# Altium schematic sheet Sheet1 3-27.SchDoc
size 457 x 419 mm
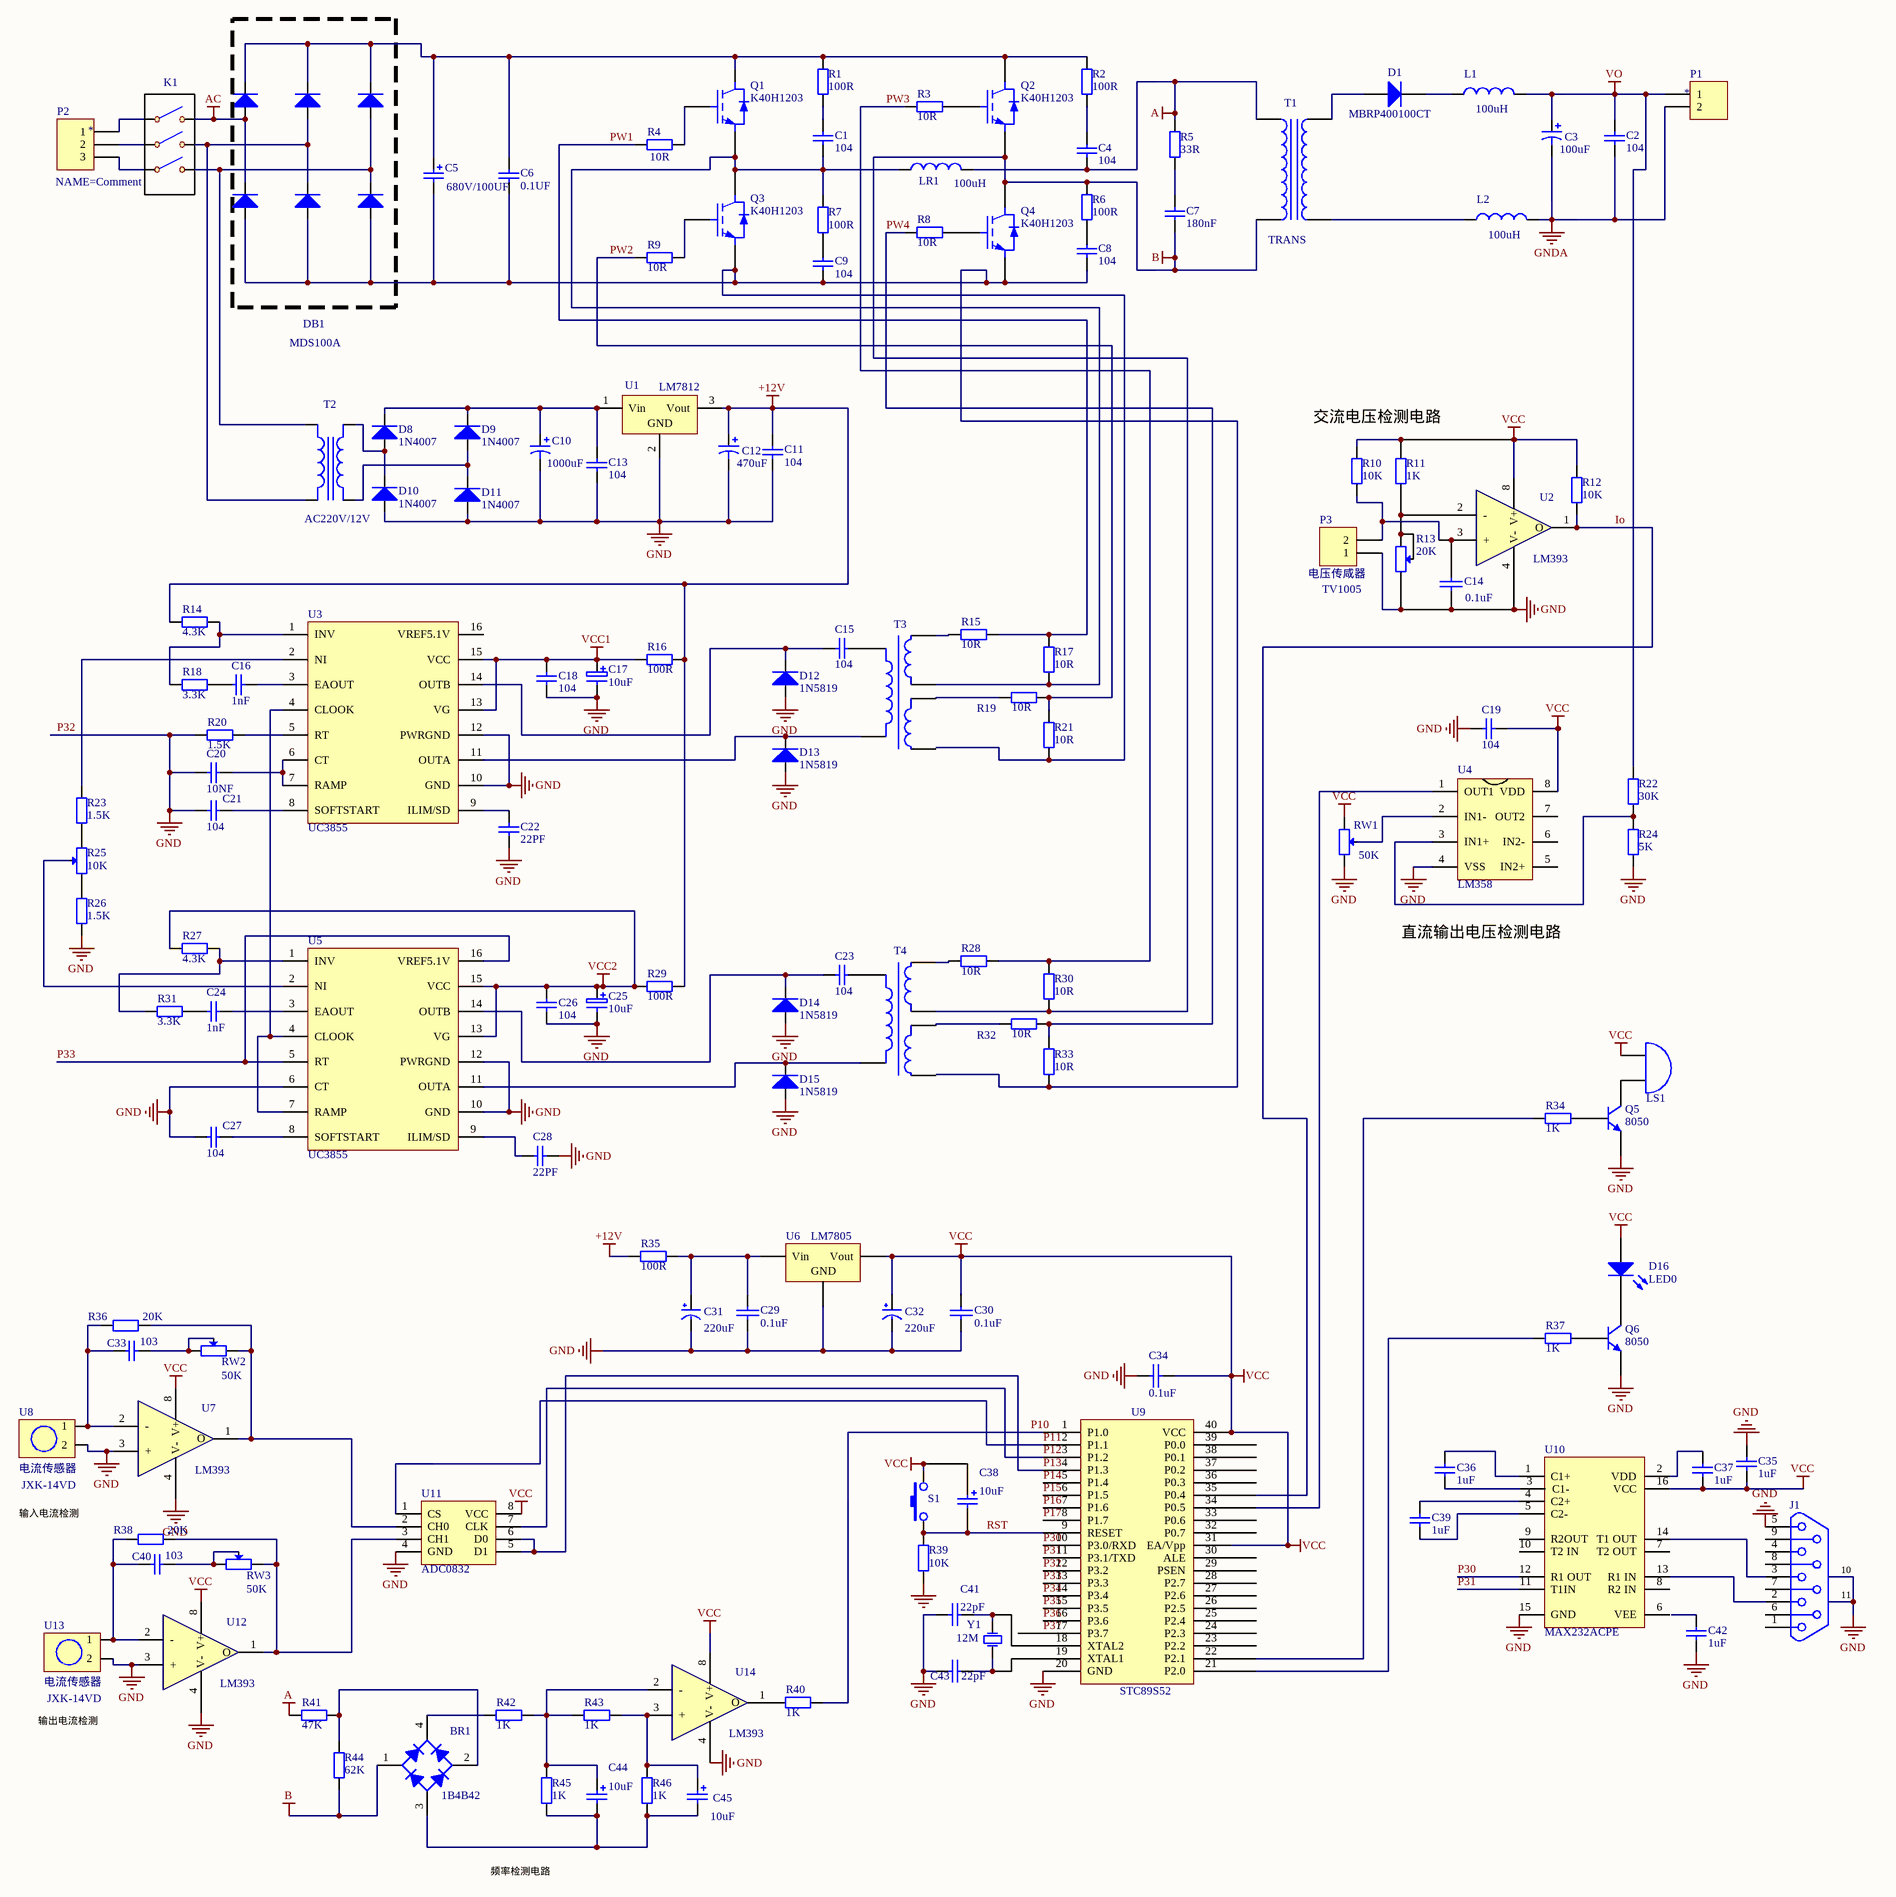
[diagram p0: Sheet1 3-27.SchDoc]

## Parts
*1  K开关_2  [K6脚开关8.5X8.5mm l]  (value not drawn)
*2  K开关_2  [K6脚开关8.5X8.5mm l]  (value not drawn)
BR1  1B4B42  [D整流桥1B4B42]
C1  104  [RAD0.1-1]
C2  104  [RAD0.1-1]
C3  100uF  [RBD10/5]
C4  104  [RAD0.1-1]
C5  680V/100UF  [CAPPA14.05-10.5x6.3]
C6  0.1UF  [RAD0.1-1]
C7  180nF  [RAD0.1-1]
C8  104  [RAD0.1-1]
C9  104  [RAD0.1-1]
C10  1000uF  [RBD10/5]
C11  104  [RAD0.1-1]
C12  470uF  [RBD10/5]
C13  104  [RAD0.1-1]
C14  0.1uF  [0805]
C15  104  [RAD0.1-1]
C16  1nF  [RAD0.1-1]
C17  10uF  [RB6.3/3.5]
C18  104  [RAD0.1-1]
C19  104  [RAD0.1-1]
C20  10NF  [RAD0.1-1]
C21  104  [RAD0.1-1]
C22  22PF  [RAD0.1-1]
C23  104  [RAD0.1-1]
C24  1nF  [RAD0.1-1]
C25  10uF  [RB6.3/3.5]
C26  104  [RAD0.1-1]
C27  104  [RAD0.1-1]
C28  22PF  [RAD0.1-1]
C29  0.1uF  [CAPR5-4X5]
C30  0.1uF  [CAPR5-4X5]
C31  220uF  [10UF/16V]
C32  220uF  [10UF/16V]
C33  103  [RAD0.1-1]
C34  0.1uF  [CAPR5-4X5]
C35  1uF  [RAD-0.3]
C36  1uF  [RAD-0.3]
C37  1uF  [RAD-0.3]
C38  10uF  [电容6.3MM]
C39  1uF  [RAD-0.3]
C40  103  [RAD0.1-1]
C41  22pF  [RAD0.2-2]
C42  1uF  [RAD-0.3]
C43  22pF  [RAD0.2-2]
C44  10uF  [电容6.3MM]
C45  10uF  [电容6.3MM]
D1  MBRP400100CT  [DO-41]
D2  1N4007  [D0-41 N]  (value not drawn)
D3  1N4007  [D0-41 N]  (value not drawn)
D4  1N4007  [D0-41 N]  (value not drawn)
D5  1N4007  [D0-41 N]  (value not drawn)
D6  1N4007  [D0-41 N]  (value not drawn)
D7  1N4007  [D0-41 N]  (value not drawn)
D8  1N4007  [D0-41 N]
D9  1N4007  [D0-41 N]
D10  1N4007  [D0-41 N]
D11  1N4007  [D0-41 N]
D12  1N5819  [D0-41 N]
D13  1N5819  [D0-41 N]
D14  1N5819  [D0-41 N]
D15  1N5819  [D0-41 N]
D16  LED0  [LED5MM 2.6 6]
J1  (no value)  [DSUB1.385-2H9]
K1  K开关_2  [K6脚开关8.5X8.5mm l]  (value not drawn)
L1  100uH  [0402-A]
L2  100uH  [0402-A]
LR1  100uH  [0402-A]
LS1  F蜂呜器  [F蜂呜器12x9.5x7.6mm]  (value not drawn)
P1  *  [HDR1X2]
P2  *  [HDR1X3]
P3  电压传咸器  LatestRevisionDate: TV1005  [HDR1X2]
Q1  K40H1203  [TO-247AC]
Q2  K40H1203  [TO-247AC]
Q3  K40H1203  [TO-247AC]
Q4  K40H1203  [TO-247AC]
Q5  8050  [TO-92 EBC]
Q6  8050  [TO-92 EBC]
R1  100R  [AXIAL-0.4 2]
R2  100R  [AXIAL-0.4 2]
R3  10R  [AXIAL-0.4 2]
R4  10R  [AXIAL-0.4 2]
R5  33R  [AXIAL-0.4 2]
R6  100R  [AXIAL-0.4 2]
R7  100R  [AXIAL-0.4 2]
R8  10R  [AXIAL-0.4 2]
R9  10R  [AXIAL-0.4 2]
R10  10K  [AXIAL-0.4]
R11  1K  [AXIAL-0.4]
R12  10K  [AXIAL-0.4]
R13  20K  [3296电位器]
R14  4.3K  [AXIAL-0.4 2]
R15  10R  [AXIAL-0.4 2]
R16  100R  [AXIAL-0.4 2]
R17  10R  [AXIAL-0.4 2]
R18  3.3K  [AXIAL-0.4 2]
R19  10R  [AXIAL-0.4 2]
R20  1.5K  [AXIAL-0.4 2]
R21  10R  [AXIAL-0.4 2]
R22  30K  [AXIAL-0.4]
R23  1.5K  [AXIAL-0.4 2]
R24  5K  [AXIAL-0.4]
R25  10K  [3296电位器]
R26  1.5K  [AXIAL-0.4 2]
R27  4.3K  [AXIAL-0.4 2]
R28  10R  [AXIAL-0.4 2]
R29  100R  [AXIAL-0.4 2]
R30  10R  [AXIAL-0.4 2]
R31  3.3K  [AXIAL-0.4 2]
R32  10R  [AXIAL-0.4 2]
R33  10R  [AXIAL-0.4 2]
R34  1K  [AXIAL-0.4]
R35  100R  [AXIAL-0.4]
R36  20K  [AXIAL-0.4]
R37  1K  [AXIAL-0.4]
R38  20K  [AXIAL-0.4]
R39  10K  [AXIAL-0.4]
R40  1K  [AXIAL-0.4]
R41  47K  [AXIAL-0.4]
R42  1K  [AXIAL-0.4]
R43  1K  [AXIAL-0.4]
R44  62K  [AXIAL-0.4]
R45  1K  [AXIAL-0.4]
R46  1K  [AXIAL-0.4]
RW1  50K  [3296电位器]
RW2  50K  [3296电位器]
RW3  50K  [3296电位器]
S1  KEY  [key - 1]  (value not drawn)
T1  1：1  [TRANS]  (value not drawn)
T2  AC220V/12V  [T变压器22V转12V 10W - duplicate]
T3  t变压器小６ＰＩＮ  [T EE20]  (value not drawn)
T4  t变压器小６ＰＩＮ  [T EE20]  (value not drawn)
U1  LM7812  [TO-220Ad]
U2  LM393  [DIP-8D]
U3  UC3855
U4  LM358
U5  UC3855
U6  LM7805  [D2PAK_L]
U7  LM393  [DIP-8D]
U8  JXK-14VD
U9  STC89S52  [DIP-40]
U10  MAX232ACPE
U11  ADC0832
U12  LM393  [DIP-8D]
U13  JXK-14VD
U14  LM393  [DIP-8D]
Y1  12M  [XTAL  L]

## Nets
+12V: C11.1 C12.1 R14.2 R16.2 R29.2 R35.1 U1.3(Vout)
A: C4.2 LR1.2 R5.1 R41.1 T1.1
AC: D2.1(A) D5.2(K) K1.2
B: BR1.1(C) C7.2 Q2.3(E) Q4.2(C) R6.2 R30.1 R44.1 T1.2 T4.2
GNDA: C2.2 C3.2 L2.2 P1.2
P32: C10.2 C11.2 C12.2 C13.2 C14.1 C17.2 C18.2 C19.1 C20.1 C21.1 C22.2 C25.2 C26.2 C27.1 C28.2 C29.2 C30.2 C31.2(GND) C32.2(GND) C34.1 C35.2 C41.1 C42.2 C43.1 D10.1(A) D11.1(A) D12.1(A) D14.1(A) J1.5 P3.1 Q5.E Q6.E R13.3 R20.2 R24.2 R26.2 R39.2 RW1.3 U1.2(GND) U2.4(V-) U3.10(GND) U3.12(PWRGND) U4.4(VSS) U5.6(CT) U5.10(GND) U5.12(PWRGND) U6.2(GND) U7.3(+) U7.4(V-) U8.2 U9.12(P3.2) U9.20(GND) U10.15(GND) U11.4(GND) U12.3(+) U12.4(V-) U13.2 U14.4(V-)  [also labelled GND]
VCC: C19.2 C30.1 C32.1(VCC) C34.2 C35.1 C37.2 C38.1 D16.1 LS1.1(A) R10.1 R11.1 R12.1 RW1.1 S1.2 U2.8(V+) U4.8(VDD) U6.3(Vout) U7.8(V+) U9.31(EA/Vpp) U9.40(VCC) U10.16(VCC) U11.8(VCC) U12.8(V+) U14.8(V+)
VCC1: C17.1 C18.1 R16.1 U3.13(VG) U3.15(VCC)
VCC2: C25.1 C26.1 R27.2 R29.1 U5.13(VG) U5.15(VCC)
VO: C2.1 C3.1 L1.2 P1.1 R22.1
Io: R12.2 U2.1(O) U9.35(P0.4)
P10: R40.2 U9.1(P1.0)
P11: U9.2(P1.1) U11.1(CS)
P12: U9.3(P1.2) U11.7(CLK)
P13: U9.4(P1.3) U11.5(D1) U11.6(D0)
P14: U9.5(P1.4)
P15: U9.6(P1.5)
P16: U9.7(P1.6)
P17: U9.8(P1.7)
P30: U9.10(P3.0/RXD) U10.12(R1_OUT)
P31: U9.11(P3.1/TXD) U10.11(T1IN)
P33: U5.5(RT) U5.16(VREF5.1V) U9.13(P3.3)
P34: U9.14(P3.4)
P35: U9.15(P3.5)
P36: U9.16(P3.6)
P37: U9.17(P3.7)
PW1: R4.1 R15.2 R17.2
PW2: R9.1 R19.2 R21.2
PW3: R3.1 R28.2 R30.2
PW4: R8.1 R32.2 R33.2
RST: C38.2 R39.1 S1.1 U9.9(RESET)
Net*1_1: *1.1 P2.2
Net*1_2: *1.2 D3.1(A) D6.2(K) T2.A(Pri-)
Net*2_1: *2.1 P2.3
Net*2_2: *2.2 D4.1(A) D7.2(K) T2.B(Pri+)
NetBR1_2: BR1.2(C) R41.2 R44.2
NetBR1_3: BR1.3(A) C44.2 C45.2 R45.1 R46.1
NetBR1_4: BR1.4(K) R42.1
NetC1_1: C1.1 R1.1
NetC1_2: C1.2 LR1.1 Q1.3(E) Q3.2(C) R7.2 R17.1 T3.2
NetC4_1: C4.1 R2.1
NetC5_1: C5.1 C6.1 D2.2(K) D3.2(K) D4.2(K) Q1.2(C) Q2.2(C) R1.2 R2.2
NetC5_2: C5.2 C6.2 C8.2 C9.2 D5.1(A) D6.1(A) D7.1(A) Q3.3(E) Q4.3(E) R21.1 R33.1
NetC7_1: C7.1 R5.2
NetC8_1: C8.1 R6.1
NetC9_1: C9.1 R7.1
NetC10_1: C10.1 C13.1 D8.2(K) D9.2(K) U1.1(Vin)
NetC14_2: C14.2 P3.2 R10.2 U2.3(+)
NetC15_1: C15.1 D12.2(K) U3.14(OUTB)
NetC15_2: C15.2 T3.5
NetC16_1: C16.1 R18.1
NetC16_2: C16.2 U3.3(EAOUT)
NetC20_2: C20.2 U3.6(CT) U3.7(RAMP)
NetC21_2: C21.2 U3.8(SOFTSTART)
NetC22_1: C22.1 U3.9(ILIM/SD)
NetC23_1: C23.1 D14.2(K) U5.14(OUTB)
NetC23_2: C23.2 T4.5
NetC24_1: C24.1 R31.1
NetC24_2: C24.2 U5.3(EAOUT)
NetC27_2: C27.2 U5.8(SOFTSTART)
NetC28_1: C28.1 U5.9(ILIM/SD)
NetC29_1: C29.1 C31.1(VCC) R35.2 U6.1(Vin)
NetC33_1: C33.1 R36.2 U7.2(-) U8.1
NetC33_2: C33.2 RW2.1 RW2.2
NetC36_1: C36.1 U10.1(C1+)
NetC36_2: C36.2 U10.3(C1-)
NetC37_1: C37.1 U10.2(VDD)
NetC39_1: C39.1 U10.4(C2+)
NetC39_2: C39.2 U10.5(C2-)
NetC40_1: C40.1 R38.2 U12.2(-) U13.1
NetC40_2: C40.2 RW3.1 RW3.2
NetC41_2: C41.2 U9.18(XTAL2) Y1.2(OSC2)
NetC43_2: C43.2 U9.19(XTAL1) Y1.1(OSC1)
NetC44_1: C44.1 R42.2 R43.1 R45.2 U14.2(-)
NetC45_1: C45.1 R43.2 R46.2 U14.3(+)
NetD1_1: D1.1(A) T1.4
NetD1_2: D1.2(K) L1.1
NetD8_1: D8.1(A) D10.2(K) T2.B(Sec+)
NetD9_1: D9.1(A) D11.2(K) T2.D(Sec-)
NetD13_2: D13.2(K) T3.6 U3.11(OUTA)
NetD15_2: D15.2(K) T4.6 U5.11(OUTA)
NetD16_2: D16.2 Q6.C
NetJ1_2: J1.2 U10.13(R1_IN)
NetJ1_3: J1.3 U10.14(T1_OUT)
NetK1_1: K1.1 P2.1
NetL2_1: L2.1 T1.3
NetLS1_2: LS1.2(B) Q5.C
NetQ1_1: Q1.1(G) R4.2
NetQ2_1: Q2.1(G) R3.2
NetQ3_1: Q3.1(G) R9.2
NetQ4_1: Q4.1(G) R8.2
NetQ5_B: Q5.B R34.2
NetQ6_B: Q6.B R37.2
NetR11_2: R11.2 R13.1 R13.2 U2.2(-)
NetR14_1: R14.1 R18.2 U3.1(INV)
NetR15_1: R15.1 T3.1
NetR19_1: R19.1 T3.3
NetR20_1: R20.1 U3.5(RT)
NetR22_2: R22.2 R24.1 U4.3(IN1+)
NetR23_1: R23.1 U3.2(NI)
NetR23_2: R23.2 R25.3
NetR25_1: R25.1 R26.1
NetR25_2: R25.2 U5.2(NI)
NetR27_1: R27.1 R31.2 U5.1(INV)
NetR28_1: R28.1 T4.1
NetR32_1: R32.1 T4.3
NetR34_1: R34.1 U9.22(P2.1)
NetR36_1: R36.1 RW2.3 U7.1(O) U11.2(CH0)
NetR37_1: R37.1 U9.21(P2.0)
NetR38_1: R38.1 RW3.3 U11.3(CH1) U12.1(O)
NetR40_1: R40.1 U14.1(O)
NetRW1_2: RW1.2 U4.2(IN1-)
NetU3_4: U3.4(CLOOK) U5.4(CLOOK) U5.7(RAMP)
NetU4_1: U4.1(OUT1) U9.34(P0.5)

Not connected (* = marked no-connect by the designer): C42 1; D13 1(A); D15 1(A); J1 1 4 6 7 8 9; T2 C(SecCT); T3 4(3); T4 4(3); U3 16(VREF5.1V); U4 5(IN2+) 6(IN2-) 7(OUT2); U9 23(P2.2) 24(P2.3) 25(P2.4) 26(P2.5) 27(P2.6) 28(P2.7) 29(PSEN) 30(ALE) 32(P0.7) 33(P0.6) 36(P0.3) 37(P0.2) 38(P0.1) 39(P0.0); U10 6(VEE) 7(T2_OUT) 8(R2_IN) 9(R2OUT) 10(T2_IN)

## Notes on the sheet
- MDS100A
- DB1
- 交流电压检测电路
- 直流输出电压检测电路
- 输入电流检测
- 10
- 11
- 输出电流检测
- 频率检测电路
- Labels drawn without touching a wire or pin: GND
- (in symbol Header 3) NAME=Comment
- (in symbol 电流互流器HR1111-CT 5A:2.5mA) 电流传感器

## Library data of the parts
BR1 = D整流桥1B4B42: Published: 8-Jun-2000; LatestRevisionDate: 29-May-2009; LatestRevisionNote: Sch pins A & K swapped.; DatasheetVersion: E2732B; PackageReference: D-38; Publisher: Altium Limited; PackageDescription: Bridge Rectifier; 4 Terminals; Body 9.4 x 9.4 mm (typ); Pitch 5.08 mm
C1 C2 C4 C6-C9 C11 C13 C15 C16 C18-C24 C26-C28 C35-C37 C39 C42 = C: Published: 8-Jun-2000; LatestRevisionDate: 17-Jul-2002; LatestRevisionNote: Re-released for DXP Platform.; PackageReference: RAD-0.3; Publisher: Altium Limited; PackageDescription: Radial Cap, Thru-Hole; 2 Leads; 0.3 in Pin Spacing
C3 C10 C12 = Cap Pol1: Polarized Capacitor (Radial); Value: 100pF; Published: 8-Jun-2000; LatestRevisionDate: 17-Jul-2002; LatestRevisionNote: Re-released for DXP Platform.; PackageReference: RB7.6-15; Publisher: Altium Limited; PackageDescription: Polarized Capacitor (Radial); 2 Leads
C5 = Cap Pol2: Polarized Capacitor (Axial); Value: 100pF; Published: 8-Jun-2000; LatestRevisionDate: 17-Jul-2002; LatestRevisionNote: Re-released for DXP Platform.; PackageReference: POLAR0.8; Publisher: Altium Limited
C14 C29 C30 C34 = CAP: 直插瓷片电容
C17 C25 = C+1: Published: 8-Jun-2000; LatestRevisionDate: 17-Jul-2002; LatestRevisionNote: Re-released for DXP Platform.; PackageReference: RB7.6-15; Publisher: Altium Limited; PackageDescription: Polarized Capacitor (Radial); 2 Leads
C31 C32 = CAP
C33 C40 = Cap: Capacitor; Value: 100pF; Published: 8-Jun-2000; LatestRevisionDate: 17-Jul-2002; LatestRevisionNote: Re-released for DXP Platform.; PackageReference: RAD-0.3; Publisher: Altium Limited; PackageDescription: Radial Cap, Thru-Hole; 2 Leads; 0.3 in Pin Spacing
C38 C44 C45 = C+: Published: 8-Jun-2000; LatestRevisionDate: 17-Jul-2002; LatestRevisionNote: Re-released for DXP Platform.; PackageReference: RB7.6-15; Publisher: Altium Limited; PackageDescription: Polarized Capacitor (Radial); 2 Leads
C41 C43 = CAP: Capacitor
D1 = D二极管: Published: 8-Jun-2000; LatestRevisionDate: 17-Jul-2002; LatestRevisionNote: Re-released for DXP Platform.; DatasheetVersion: 1998; PackageVersion: Aug-1999; PackageReference: DO-41; Publisher: Altium Limited; PackageDescription: Diode, Axial; Body 5.2 x 2.7 mm (LxDia. max), Lead Dia. 0.86 mm (max); Code_JEDEC: DO-204-AL; ComponentLink1Description: Manufacturer Link; ComponentLink1URL: http://www.fairchildsemi.com/; ComponentLink2Description: Datasheet; ComponentLink2URL: http://www.fairchildsemi.com/ds/1N%2F1N4001.pdf
D2-D15 = D
D16 = LED 12: Published: 8-Jun-2000; LatestRevisionDate: 08-Jul-2005; LatestRevisionNote: Mech Layer 1 removed.; PackageReference: LED-1; Publisher: Altium Limited; PackageDescription: LED; 2 Leads
J1 = DB9串口: 串口
L1 L2 LR1 = D电感: Code_IEC: 1005; Published: 8-Jun-2000; LatestRevisionDate: 29-May-2009; LatestRevisionNote: IPC-7351 Footprint Added.; PackageReference: 0402-A; Publisher: Altium Limited; PackageDescription: Chip Inductor; Code_JEITA: 0402
P1 P3 = Header 2: Header, 2-Pin; LatestRevisionNote: Re-released for DXP Platform.; Publisher: Altium Limited
  P1: LatestRevisionDate: 17-Jul-2002
P2 = Header 3: Header, 3-Pin; LatestRevisionDate: 17-Jul-2002; LatestRevisionNote: Re-released for DXP Platform.; Publisher: Altium Limited
Q1-Q4 = IGBT 2_1: Insulated Gate Bipolar Transistor with Ultrafast Soft Recovery Diode; Note: Pin 2 (collector) is electrically connected to the BASE; Published: 8-Jun-2000; LatestRevisionDate: 17-Jul-2002; LatestRevisionNote: Re-released for DXP Platform.; DatasheetVersion: Apr-1997; PackageVersion: Aug-1997; PackageReference: TO-247AC; Publisher: Altium Limited; PackageDescription: SIP with Mounting Hole; 3 Leads; Body 20 x 15.6 x 5 mm (typ); Pitch 5.45 mm; Code_JEDEC: TO-247-AC; ComponentLink1Description: Manufacturer Link; ComponentLink1URL: http://www.irf.com/; ComponentLink2Description: Datasheet; ComponentLink2URL: http://www.irf.com/product-info/datasheets/data/irg4pc40ud.pdf
Q5 Q6 = NPN  EBC80509018: Published: 8-Jun-2000; LatestRevisionDate: 15-Jan-2003; LatestRevisionNote: PCB Footprint 'BCY-W3/D4.7' replaced; DatasheetVersion: 1997; PackageVersion: Sep-1998; PackageReference: TO-92A; Publisher: Altium Limited; PackageDescription: TO, Flat Index; 3 In-Line, Axial Leads; Body Dia. 4.5mm; Leads 0.51 x 0.48 mm (max); ComponentLink1Description: Manufacturer Link; ComponentLink1URL: http://www.fairchildsemi.com/; ComponentLink2Description: Datasheet; ComponentLink2URL: http://www.fairchildsemi.com/ds/2N%2F2N3904.pdf
R1-R9 R14-R21 R23 R26-R33 = R1: Published: 8-Jun-2000; LatestRevisionDate: 17-Jul-2002; LatestRevisionNote: Re-released for DXP Platform.; PackageReference: AXIAL-0.4; Publisher: Altium Limited; PackageDescription: Axial Device, Thru-Hole; 2 Leads; 0.4 in Pin Spacing
R10-R12 R34 R35 R37 R39-R46 = R电阻1: Published: 8-Jun-2000; LatestRevisionDate: 17-Jul-2002; LatestRevisionNote: Re-released for DXP Platform.; PackageReference: AXIAL-0.4; Publisher: Altium Limited; PackageDescription: Axial Device, Thru-Hole; 2 Leads; 0.4 in Pin Spacing
R13 R25 RW1-RW3 = RW
R22 R24 R36 R38 = Res2: Resistor; Value: 1K; Published: 8-Jun-2000; LatestRevisionDate: 17-Jul-2002; LatestRevisionNote: Re-released for DXP Platform.; PackageReference: AXIAL-0.4; Publisher: Altium Limited; PackageDescription: Axial Device, Thru-Hole; 2 Leads; 0.4 in Pin Spacing
T1 = T电压线圈变压器_1: Published: 24-Mar-1999; LatestRevisionDate: 08-Jul-2005; LatestRevisionNote: Mech Layer 1 removed.; PackageReference: TRANS; Publisher: Altium Limited; PackageDescription: Transformer; 4 Leads
T2 = T变压器20171: Published: 8-Jun-2000; LatestRevisionDate: 17-Jul-2002; LatestRevisionNote: Re-released for DXP Platform.; PackageReference: TRF_5; Publisher: Altium Limited; PackageDescription: Transformer; 5 Leads
T3 T4 = t变压器小６ＰＩＮ_1_1
U1 = 78**
U6 = W稳压管7805: Published: 24-Mar-1999; LatestRevisionDate: 29-May-2009; LatestRevisionNote: IPC-7351 Footprint Added.; PackageReference: D2PAK; Publisher: Altium Limited; PackageDescription: 3-Pin Transistor Outline Package 2.54 mm Pitch, 15.1 mm Lead Span
U8 U13 = 电流互流器HR1111-CT 5A:2.5mA
U9 = 89S52
Y1 = XTAL
LS1 = F蜂呜器: Published: 24-Mar-1999; LatestRevisionDate: 17-Jul-2002; LatestRevisionNote: Re-released for DXP Platform.; PackageReference: PIN2; Publisher: Altium Limited